# Altium schematic sheet Smartwatch_PowerManagement.SchDoc
size A4; SheetNumber: 2; SheetTotal: 4
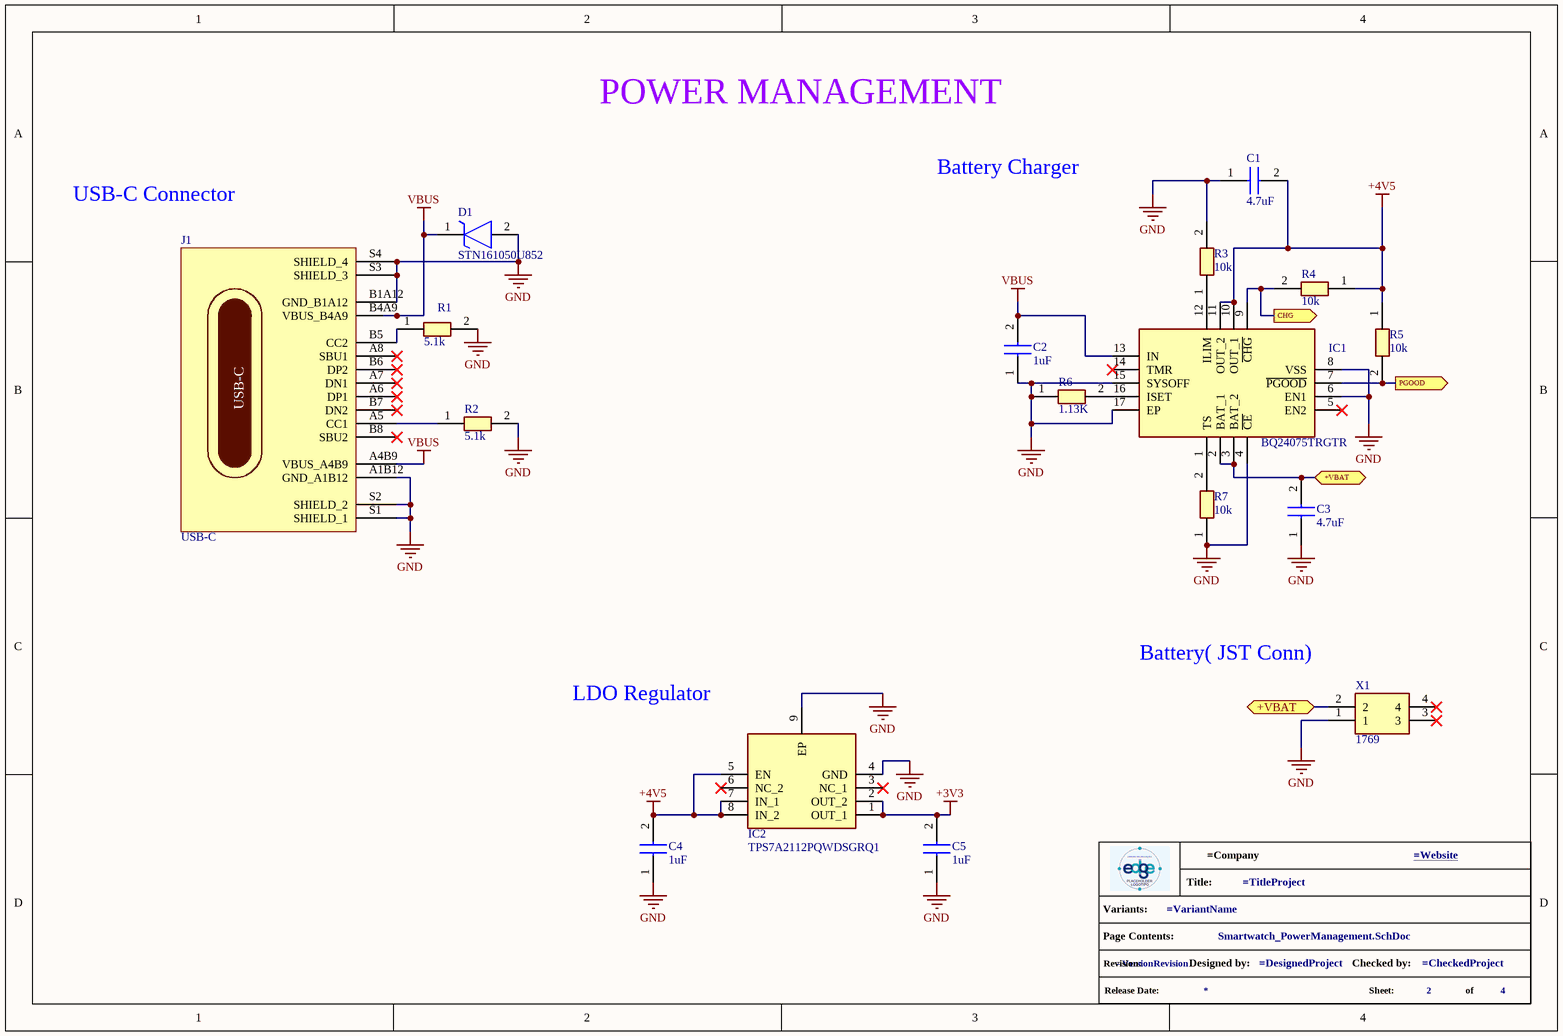
[diagram p0: Smartwatch_PowerManagement.SchDoc]

## Parts
*?  info_project  (value not drawn)  (graphical)
C1  4.7uF  [CAPC1005X65N]
C2  1uF  [CAPC1005X65N]
C3  4.7uF  [CAPC1005X65N]
C4  1uF  [CAPC1005X65N]
C5  1uF  [CAPC1005X65N]
D1  STN161050U852  [STN161050U852]
IC1  BQ24075TRGTR  [QFN50P300X300X100-17N-D]
IC2  TPS7A2112PQWDSGRQ1  [SON50P200X200X80-9N]
J1  USB-C  [FP-2171790001-MFG]
R1  5.1k  [RESC1005X40]
R2  5.1k  [RESC1005X40]
R3  10k  [RESC1005X37N]
R4  10k  [RESC1005X37N]
R5  10k  [RESC1005X37N]
R6  1.13K  [RESC1005X37N]
R7  10k  [RESC1005X37N]
X1  1769  [1769]

## Ports
+VBAT (bidir, see 2[4B]), +VBAT (bidir, see 2[4C]), CHG (out, see 3[1C]), PGOOD (out, see 3[1C])

## Nets
+3V3: C5.2 IC2.1(OUT_1) IC2.2(OUT_2)
+4V5: C1.2 C4.2 IC1.10(OUT_1) IC1.11(OUT_2) IC2.5(EN) IC2.7(IN_1) IC2.8(IN_2) R4.1 R5.1
GND: C1.1 C2.1 C3.1 C4.1 C5.1 D1.2(A) IC1.4(~{CE}) IC1.6(EN1) IC1.8(VSS) IC1.15(SYSOFF) IC1.17(EP) IC2.4(GND) IC2.9(EP) J1.A1B12(GND_A1B12) J1.B1A12(GND_B1A12) J1.S1(SHIELD_1) J1.S2(SHIELD_2) J1.S3(SHIELD_3) J1.S4(SHIELD_4) R1.2 R2.2 R3.2 R6.1 R7.1 X1.1
VBUS: C2.2 D1.1(K) IC1.13(IN) J1.A4B9(VBUS_A4B9) J1.B4A9(VBUS_B4A9)
+VBAT: C3.2 IC1.2(BAT_1) IC1.3(BAT_2) X1.2 ; port +VBAT
CHG: IC1.9(~{CHG}) R4.2 ; port CHG
PGOOD: IC1.7(~{PGOOD}) R5.2 ; port PGOOD
NetIC1_1: IC1.1(TS) R7.2
NetIC1_12: IC1.12(ILIM) R3.1
NetIC1_16: IC1.16(ISET) R6.2
NetJ1_A5: J1.A5(CC1) R2.1
NetJ1_B5: J1.B5(CC2) R1.1

Not connected (* = marked no-connect by the designer): IC1 5(EN2)* 14(TMR)*; IC2 3(NC_1)* 6(NC_2)*; J1 A6(DP1)* A7(DN1)* A8(SBU1)* B6(DP2)* B7(DN2)* B8(SBU2)*; X1 3* 4*

## Notes on the sheet
- POWER MANAGEMENT
- Battery Charger
- USB-C Connector
- (near IC2) LDO Regulator
- (near X1) Battery( JST Conn)
- (in symbol info_project) Title:; Variants:; Page Contents:; Revision:; Designed by:; Checked by:; Release Date:; Sheet:; of

## Library data of the parts
C1 C3 = GRM31CR61A475KA01L: Multilayer Ceramic Capacitors MLCC - SMD/SMT 4.7 uF 10 VDC 20% 0402 X5R; Manufacturer_Name: Murata Electronics; Datasheet Link: http://www.murata.com/~/media/webrenewal/support/library/catalog/products/capacitor/mlcc/c02e.pdf; Height: 1.8mm; Manufacturer_Part_Number: GRM31CR61A475KA01L; Mouser Part Number: 81-GRM426R475K10L; Mouser Price/Stock: https://www.mouser.co.uk/ProductDetail/Murata-Electronics/GRM31CR61A475KA01L?qs=v6FXEKp3YeVDfOIVbbYCqg%3D%3D; Arrow Part Number: GRM31CR61A475KA01L; Arrow Price/Stock: https://www.arrow.com/en/products/grm31cr61a475ka01l/murata-manufacturing
C2 C4 C5 = CC0402KRX5R6BB105: Multilayer Ceramic Capacitors MLCC - SMD/SMT 10V 1uF X5R 0402 10% HI CV; Manufacturer_Name: YAGEO; Datasheet Link: https://www.yageo.com/upload/media/product/app/datasheet/mlcc/upy-gphc_x5r_4v-to-50v.pdf; Height: 0.55mm; Manufacturer_Part_Number: CC0402KRX5R6BB105; Mouser Part Number: 603-CC402KRX5R6BB105; Mouser Price/Stock: https://www.mouser.co.uk/ProductDetail/YAGEO/CC0402KRX5R6BB105?qs=BKNoF%2F0xMNu0TvpE6ze2Iw%3D%3D; Arrow Part Number: CC0402KRX5R6BB105; Arrow Price/Stock: https://www.arrow.com/en/products/cc0402krx5r6bb105/yageo?region=nac
D1 = STN161050U852: TVS Diode (Uni-directional); Manufacturer_Name: Eaton; Datasheet Link: https://www.digikey.com/en/products/detail/eaton-electronics-division/STN161050U852/13280470?msockid=3e3afa68a50969ca3057ef1ca4c9684b; Height: 0.55mm; Manufacturer_Part_Number: STN161050U852; Mouser Part Number: 504-STN161050U852; Mouser Price/Stock: https://www.mouser.co.uk/ProductDetail/Bussmann-Eaton/STN161050U852?qs=DPoM0jnrROX%2FlbVCTeWaTw%3D%3D
IC1 = BQ24075TRGTR: Gerenciadores de bateria 1.5A USB-Friendly Li Ion Batt Charger; Manufacturer_Name: Texas Instruments; Datasheet Link: http://componentsearchengine.com/Datasheets/1/BQ24075TRGTR.pdf; Height: 1mm; Manufacturer_Part_Number: BQ24075TRGTR; Mouser Part Number: 595-BQ24075TRGTR; Mouser Price/Stock: https://www.mouser.co.uk/ProductDetail/Texas-Instruments/BQ24075TRGTR?qs=%2Fqzd9s%252BcLd4uxZAT5jNskQ%3D%3D; Arrow Part Number: BQ24075TRGTR; Arrow Price/Stock: https://www.arrow.com/en/products/bq24075trgtr/texas-instruments?region=nac
IC2 = TPS7A2112PQWDSGRQ1: LDO Voltage Regulators Automotive, 500mA, low-noise ultra-low-IQ high-PSRR low-dropout (LDO) voltage regulator; Manufacturer_Name: Texas Instruments; Datasheet Link: https://www.ti.com/lit/gpn/tps7a21-q1; Height: 0.8mm; Manufacturer_Part_Number: TPS7A2112PQWDSGRQ1
J1 = 217179-0001: USB Connector, 16 Contact(s), Female, Right Angle, Surface Mount Terminal, Locking, Receptacle; Manufacturer: Molex; Supplier: Mouser; Supplier Part Number: 538-217179-0001; Manufacturer Part Number: 217179-0001; RoHS: No; Category: USB Connectors; Stock: 4841; Pricing: 1=0,9, 10=0,745, 50=0,745, 100=0,622, 1000=0,622, 10000=0,446 (USD)
R1 R2 = ERJ-2RHD512X: Fixed Resistor, Metal Glaze/thick Film, 0.063W, 5110ohm, 50V, 0.5% +/-Tol, 50ppm/Cel, Surface Mount, 0402; Manufacturer: Panasonic; Manufacturer Series: ERJ2R; Power: 63mW; Rated Temperature: 70°C; Value: 5.11kR; Temperature Coefficient: 50ppm/°C; Supplier: Mouser; Supplier Part Number: 667-ERJ-2RHD512X; Manufacturer Part Number: ERJ-2RHD512X; RoHS: Yes; Stock: 18329; Pricing: 1=0,13, 10=0,11, 50=0,11, 100=0,043, 1000=0,019, 10000=0,019 (USD); Mounting Technology: Surface Mount; Pins: 2; Package Shape: Rectangular; Case/Package: 0402; Terminal Finish: Tin; Min Operating Temperature: -55°C; Max Operating Temperature: 125°C; Tolerance: 0.5%; JESD-609 Code: e3; Resistor Type: FIXED RESISTOR; Packaging: Tape and Reel; Technology: METAL GLAZE/THICK FILM; Termination: Wraparound; Working Voltage: 50V; Reach SVHC Compliant: Yes; RoHS Compliant: Yes; ComponentLink1URL: https://datasheet.ciiva.com:443/pdfs/VipMasterCap/Capacitor/PANA/PANAS11022/PANAS11022-1.pdf?src-supplier=IHS+Markit; ComponentLink1Description: https://datasheet.ciiva.com:443/pdfs/VipMasterCap/Capacitor/PANA/PANAS11022/PANAS11022-1.pdf?src-supplier=IHS+Markit; ComponentLink2URL: https://datasheet.ciiva.com/24037/aoa0000ce2-24037669.pdf?src-supplier=Mouser; ComponentLink2Description: https://datasheet.ciiva.com/24037/aoa0000ce2-24037669.pdf?src-supplier=Mouser
R3-R5 R7 = MCS0402MD1002BE100: Resistores de Filme Fino - SMD .063W 10Kohms 0.1% 0402 25ppm Auto; Manufacturer_Name: Vishay; Datasheet Link: http://www.vishay.com/docs/28705/mcx0x0xpro.pdf; Height: 0.37mm; Manufacturer_Part_Number: MCS0402MD1002BE100; Mouser Part Number: 594-MCS0402MD1002BE1; Mouser Price/Stock: https://www.mouser.co.uk/ProductDetail/Vishay-Beyschlag/MCS0402MD1002BE100?qs=3SvaY9RawMIFge2HspqWnA%3D%3D; Arrow Part Number: MCS0402MD1002BE100; Arrow Price/Stock: https://www.arrow.com/en/products/mcs0402md1002be100/vishay?region=nac
R6 = AF0402FR-071K13L: Fixed Resistor, Metal Glaze/thick Film, 0.0625W, 1130ohm, 50V, 1% +/-Tol, 100ppm/Cel, Surface Mount, 0402; Manufacturer: Yageo; Additional Feature: ANTI-SULFUR; Power: 62.5mW; Rated Temperature: 70°C; Value: 1.13kR; Temperature Coefficient: 100ppm/°C; Package Height: 0.32mm; Package Length: 1mm; Package Width: 0.5mm; Reference Standard: AEC-Q200; Supplier: Mouser; Supplier Part Number: 603-AF0402FR-071K13L; Manufacturer Part Number: AF0402FR-071K13L; RoHS: Yes; Category: Chip SMD Resistors; Stock: 3100; Pricing: 1=0,15, 10=0,037, 50=0,037, 100=0,02, 1000=0,012, 10000=0,006 (USD); Mounting Technology: Surface Mount; Pins: 2; Case/Package: 0402; Min Operating Temperature: -55°C; Max Operating Temperature: 155°C; Tolerance: 1%; Resistor Type: FIXED RESISTOR; Construction: Rectangular; Package Style: SMTMeter; Packaging: Tape and Reel; Termination: Wraparound; Working Voltage: 50V; Reach SVHC Compliant: Yes; RoHS Compliant: Yes; ComponentLink1URL: https://datasheet.ciiva.com:443/pdfs/VipMasterIC/IC/YAGO/YAGO-S-A0009016998/YAGO-S-A0009016998-1.pdf?src-supplier=IHS+Markit; ComponentLink1Description: https://datasheet.ciiva.com:443/pdfs/VipMasterIC/IC/YAGO/YAGO-S-A0009016998/YAGO-S-A0009016998-1.pdf?src-supplier=IHS+Markit; ComponentLink2URL: https://www.yageo.com/upload/media/product/productsearch/datasheet/rchip/PYu-AF_51_RoHS_L_6.pdf?src-supplier=Digikey; ComponentLink2Description: https://www.yageo.com/upload/media/product/productsearch/datasheet/rchip/PYu-AF_51_RoHS_L_6.pdf?src-supplier=Digikey
X1 = 1769: Adafruit Accessories JST-PH 2-pin SMT Right Angle Connect; Datasheet Link: https://cdn-shop.adafruit.com/datasheets/17311.pdf; Height: 5.5mm; Manufacturer_Name: Adafruit; Manufacturer_Part_Number: 1769; Mouser Part Number: 485-1769; Mouser Price/Stock: https://www.mouser.co.uk/ProductDetail/Adafruit/1769?qs=GURawfaeGuBbgoGtf2XstA%3D%3D; Arrow Part Number: 1769; Arrow Price/Stock: https://www.arrow.com/en/products/1769/adafruit-industries?utm_currency=USD&region=nac